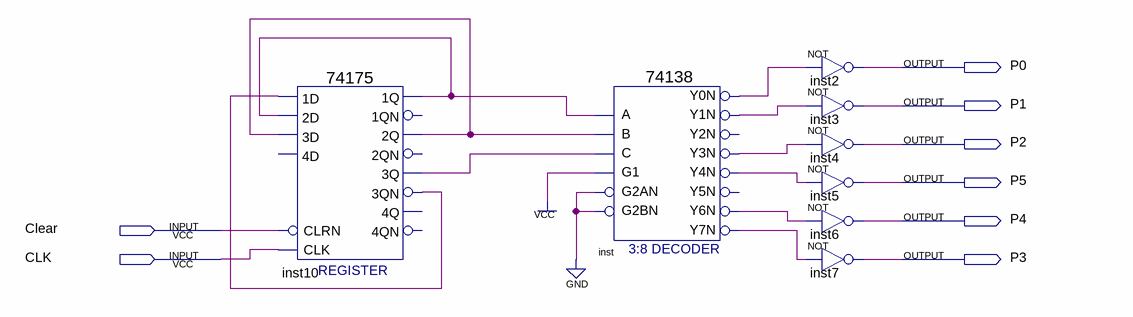
[diagram p0: schematic sheet]
// Quartus schematic phaseDecoder.bdf as structural Verilog: 8 symbols, 8 pins
module phaseDecoder (
  input  Clear,
  input  CLK,
  output P0,
  output P1,
  output P2,
  output P5,
  output P4,
  output P3
);

  wire inst10_1q, inst10_2q, inst10_3q, inst10_3qn, inst_y0n, inst_y1n, inst_y3n, inst_y4n, inst_y6n,
       inst_y7n;

  \74175  inst10 (
    .CLRN(Clear), .CLK(CLK), .\3D (inst10_2q), .\2D (inst10_1q), .\1D (inst10_3qn), .\1Q (inst10_1q),
    .\3Q (inst10_3q), .\2Q (inst10_2q), .\3QN (inst10_3qn));  // open: 4D, 1QN, 2QN, 4QN, 4Q
  \74138  inst (
    .A(inst10_1q), .B(inst10_2q), .G1(1'b1), .C(inst10_3q), .G2AN(1'b0), .G2BN(1'b0), .Y0N(inst_y0n),
    .Y1N(inst_y1n), .Y3N(inst_y3n), .Y4N(inst_y4n), .Y6N(inst_y6n), .Y7N(inst_y7n));  // open: Y2N, Y5N
  not inst2 (P0, inst_y0n);
  not inst3 (P1, inst_y1n);
  not inst4 (P2, inst_y3n);
  not inst5 (P5, inst_y4n);
  not inst6 (P4, inst_y6n);
  not inst7 (P3, inst_y7n);
endmodule
